# Altium schematic sheet AMIN.SchDoc: MAIN 原理图
size A4; Address1: 原理图 吴国才; Address2: PCB 吴国才; DocumentNumber: 1; Revision: V1.0; SheetNumber: 1; SheetTotal: 3
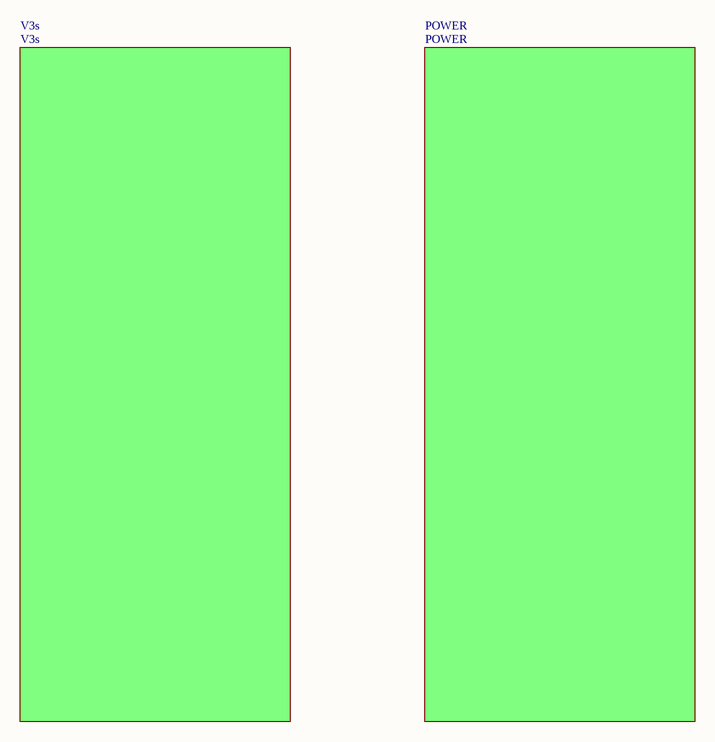
[diagram p0: AMIN.SchDoc]

## Sub-sheets
POWER = POWER: no entries
V3s = V3s: no entries

## Notes on the sheet
- Title
- Size:
- Date:
- A4
- Number:
- Time:
- Revision:
- Sheet
- of
- File: